# EasyEDA Pro project 密码存储器.eprj, schematic Schematic2
Board Name: Board2; Create Date: 2025-01-25; Page Name: P1; Project Name: 密码存储器; Schematic Name: Schematic2; Update Date: 2025-01-25; Company: 嘉立创EDA; Page Size: A4; Version: V1.0
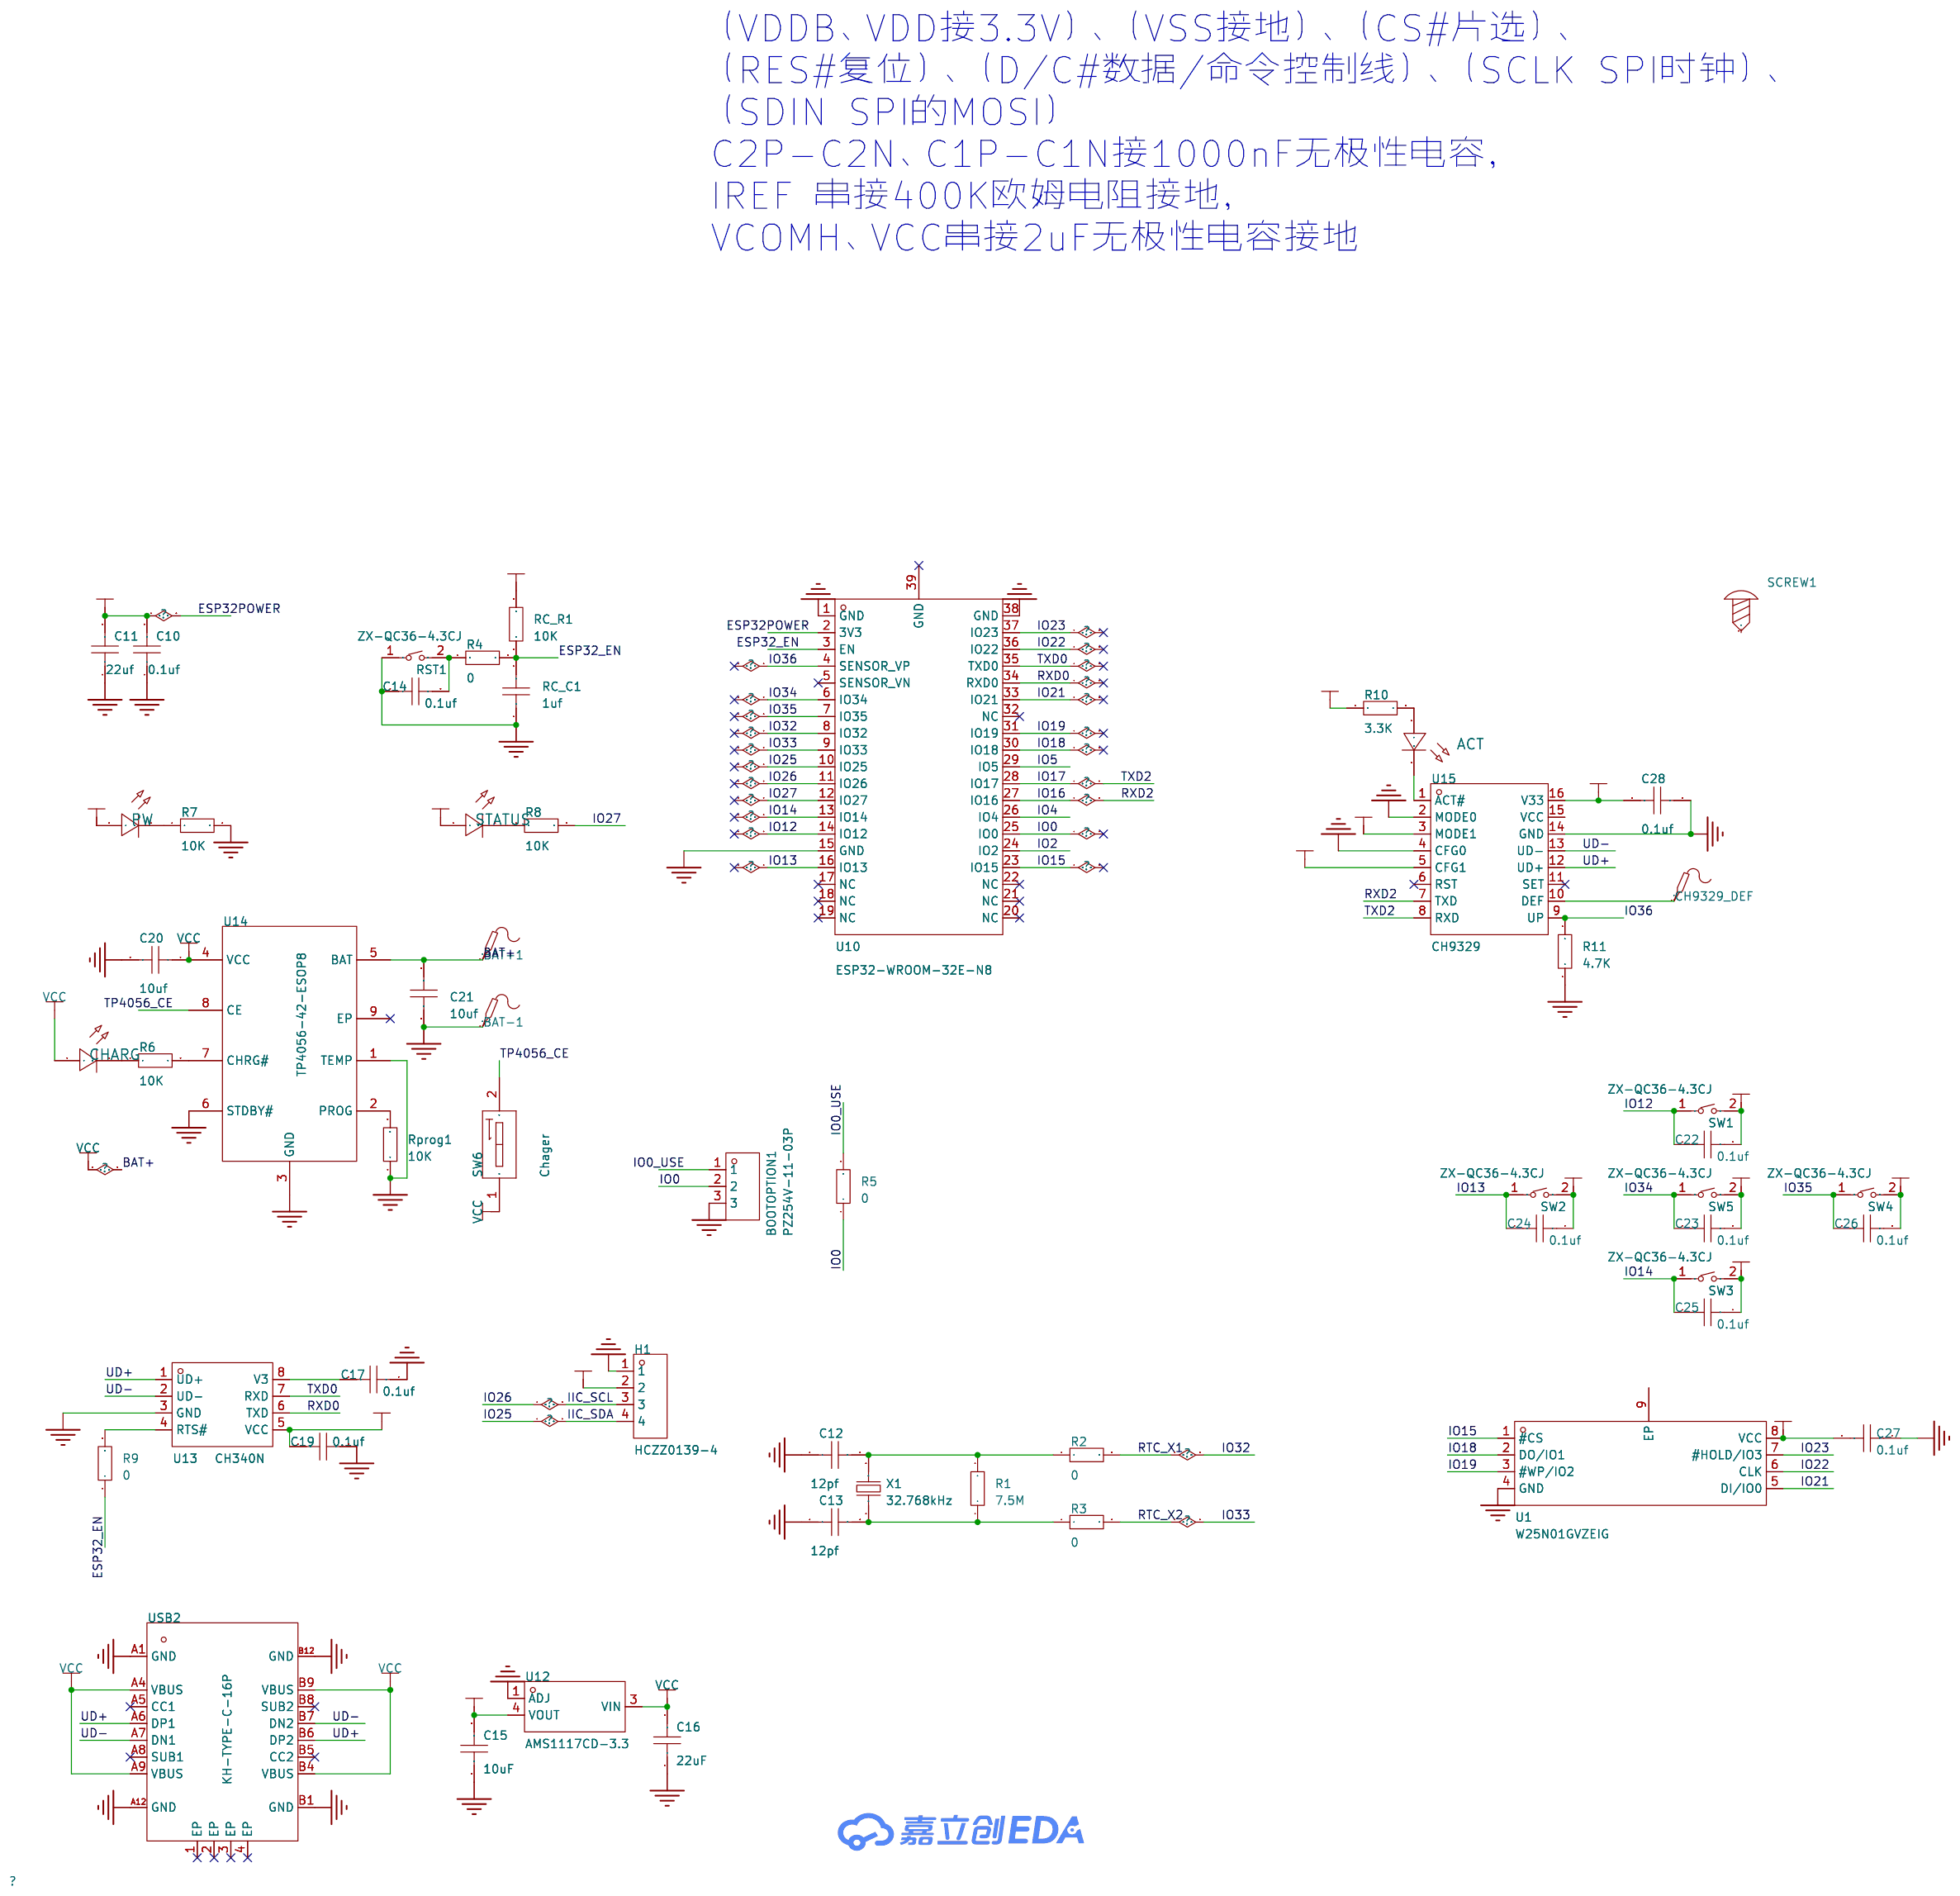
[diagram p1: schematic sheet]

## Parts
ACT  -  [LED_0805]
BAT+1  -  [Test-Point-0.5mm]
BAT-1  -  [Test-Point-0.5mm]
BOOTOPTION1  PZ254V-11-03P  [HDR-TH_3P-P2.54-V-M]
C10  0.1uf  [C0805]
C11  22uf  [C0805]
C12  12pf  [C0805]
C13  12pf  [C0805]
C14  0.1uf  [C0805]
C15  10uF  [CAP-SMD_L2.1-W1.4-FD]
C16  22uF  [CAP-SMD_L2.1-W1.4-FD]
C17  0.1uf  [C0805]
C19  0.1uf  [C0805]
C20  10uf  [C0805]
C21  10uf  [C0805]
C22  0.1uf  [C0805]
C23  0.1uf  [C0805]
C24  0.1uf  [C0805]
C25  0.1uf  [C0805]
C26  0.1uf  [C0805]
C27  0.1uf  [C0805]
C28  0.1uf  [C0805]
CH9329_DEF  -  [Test-Point-0.5mm]
CHARG  -  [LED_0805]
H1  HCZZ0139-4  [CONN-TH_4P-P2.50_HCZZ0139-4]
PW  -  [LED_0805]
R1  7.5M  [R0805]
R2  0  [R0805]
R3  0  [R0805]
R4  0  [R0805]
R5  0  [R0805]
R6  10K  [R0805]
R7  10K  [R0805]
R8  10K  [R0805]
R9  0  [R0805]
R10  3.3K  [R0805]
R11  4.7K  [R0805]
RC_C1  1uf  [C0805]
RC_R1  10K  [R0805]
Rprog1  10K  [R0805]
RST1  ZX-QC36-4.3CJ  [KEY-TH_L6.0-W3.5-P6.50]
SCREW1  -  [M3螺丝]
STATUS  -  [LED_0805]
SW1  ZX-QC36-4.3CJ  [KEY-TH_L6.0-W3.5-P6.50]
SW2  ZX-QC36-4.3CJ  [KEY-TH_L6.0-W3.5-P6.50]
SW3  ZX-QC36-4.3CJ  [KEY-TH_L6.0-W3.5-P6.50]
SW4  ZX-QC36-4.3CJ  [KEY-TH_L6.0-W3.5-P6.50]
SW5  ZX-QC36-4.3CJ  [KEY-TH_L6.0-W3.5-P6.50]
SW6  Chager  [SW-TH_DSWB01LHGET]
U1  W25N01GVZEIG  [WSON-8_L8.0-W6.10-P1.27-TL-EP]
U10  ESP32-WROOM-32E-N8  [WIFI-SMD_ESP32-WROOM-32E]
U12  AMS1117CD-3.3  [TO-252-2_L6.5-W6.1-P4.58-LS10.0-BR]
U13  CH340N  [SOP-8_L4.9-W3.9-P1.27-LS6.0-BL]
U14  TP4056-42-ESOP8  [ESOP-8_L4.9-W3.9-P1.27-LS6.0-BL-EP]
U15  CH9329  [SOP-16_L9.9-W3.9-P1.27-LS6.0-BL]
USB2  KH-TYPE-C-16P  [USB-C-SMD_KH-TYPE-C-16P]
X1  32.768kHz  [FC-135R_L3.2-W1.5]

## Library data of the parts
ACT = LED_0805-R: Supplier Footprint: 0805
BAT+1 BAT-1 = Test-Point: Test Point 测试点; Check: true
BOOTOPTION1 = PZ254V-11-03P: 插针结构:1x3P;间距:2.54mm;行距:-;圆针/方针:方针;安装类型:直插;排数:单排;总PIN位数:3P;额定电流:3A;额定电压:250V;配合针长度:6mm;塑高:2.5mm;端接针长度:3mm;工作温度范围:-40℃~+105℃;颜色:黑色;; LCSC Part Name: 间距:2.54mm 1x3P 直插 方针; Supplier Part: C2937625; Manufacturer: XFCN(兴飞); Supplier Footprint: 插件,P=2.54mm; JLCPCB Part Class: 扩展库; Datasheet: https://atta.szlcsc.com/upload/public/pdf/source/20200309/C492402_8335C3D49C4E4C618838D59BB1D024C1.pdf; Supplier: LCSC; Pin Structure: 1x3P; Pitch: 2.54mm; Circluar Pins/Square Pins: 方针; Mounting Type: 直插; Number of Rows: 单排; Number of Pins: 3P; Current Rating (Max): 3A; Voltage Rating (Max): 250V; Length of Mating Pin: 6mm; Insulation Height: 2.5mm; Length of End Connection Pin: 3mm; Operating Temperature Range: -40℃~+105℃; Color: 黑色; Check: true
C10-C14 C17 C19-C27 RC_C1 = CAP_0805: Supplier Footprint: 0805; Check: true
C15 C16 = TAJP106M010RNJ: LCSC Part Name: 10uF ±20% 10V; Supplier Part: C1952866; Manufacturer: Kyocera AVX; Supplier Footprint: 0805; JLCPCB Part Class: Extended Part; Datasheet: https://atta.szlcsc.com/upload/public/pdf/source/20200508/C528414_E7647BF5233468AE8B10D12AED045AE0.pdf; Supplier: LCSC; Tolerance: ±20%; Voltage Rated: 10V; Equivalent Series Resistance(ESR): 6Ω; Operating Temperature: -55℃~+125℃
C28 = CAP_0805: Supplier Footprint: 0805
CH9329_DEF = Test-Point: Test Point 测试点
CHARG = LED_0805-R: 充电指示; Supplier Footprint: 0805; Check: true
H1 = HCZZ0139-4: LCSC Part Name: 米色 1x4P 间距:2.5mm 弯插 系列:XH; Supplier Part: C7433739; Manufacturer: HC(虹成电子); Supplier Footprint: 弯插,p=2.54mm; JLCPCB Part Class: Extended Part; Datasheet: https://atta.szlcsc.com/upload/public/pdf/source/20250106/5080EEC5004CD340B84A691F8C6625BC.pdf; Supplier: LCSC; Pins Structure: 1x4P; Pitch: 2.5mm; Mounting Type: 弯插; Reference Series: XH; Number of Pins: 4P; Number of Rows: 1; Number of PINs Per Row: 4; Current Rating: 3A; Contact Material: 铜; Contact Plating: 锡; Operating Temperature: -25℃~+85℃; Voltage Rating: 250V; Plastic Material: PA66; Color: 米色; Z-Height of the Board: 5.8mm; X-Length of Bottom Edge on Board (Spacing Line): 12.5mm; Y-Width of Bottom Edge on Board: 7mm
PW = LED_0805-R: 电源指示; Supplier Footprint: 0805
R1-R8 RC_R1 Rprog1 = Res_0805: Supplier Footprint: 0805; Check: true
R9-R11 = Res_0805: Supplier Footprint: 0805
RST1 SW1-SW5 = ZX-QC36-4.3CJ: 电路结构:单刀单掷;按钮形状:矩形按钮;作用力:2.6N;安装方式:直插;开关长度:3mm;开关宽度:6mm;开关高度:4.3mm;带支架:不带支架;触点电流:50mA;额定电压:12V;机械寿命:10万次;; LCSC Part Name: 3*6*4.3插件开关; Supplier Part: C7470223; Manufacturer: Megastar(兆星); Supplier Footprint: DIP; JLCPCB Part Class: 扩展库; Datasheet: https://atta.szlcsc.com/upload/public/pdf/source/20230724/E786959C53B2405F67FB2C8E5CC6989E.pdf; Supplier: LCSC; Circuit: 单刀单掷; Actuator Style: 矩形按钮; Operating Force: 2.6N; Mounting Style: 直插; Switch Length: 3mm; Switch Width: 6mm; Switch Height: 4.3mm; Strike Gundam: 不带支架; Contact Current: 50mA; Voltage Rating: 12V; Actuator/Cap Color: 白色; Pin Style: PC引脚; Mechanical Life: 10万次; Operating Temperature: -30℃~+80℃; Check: true
SCREW1 = M3螺丝: Supplier Footprint: 插件
STATUS = LED_0805-R: 状态指示灯; Supplier Footprint: 0805
SW6 = DSWB01LHGET: 类型:平拨,凸起式;电路结构:单刀单掷;开关位数:1位;使用寿命:-;颜色:红色;; LCSC Part Name: 红色宽体1位顶拨插件; Supplier Part: C126888; Manufacturer: YE; Supplier Footprint: 插件,9.9x4mm; JLCPCB Part Class: 扩展库; Datasheet: https://atta.szlcsc.com/upload/public/pdf/source/20240423/2AB41BE17D24959C6789B2A71E54D492.pdf; Supplier: LCSC; Type: 平拨,凸起式; Circuit: 单刀单掷; Number of Positions: 1位; Color: 红色; Check: true
U1 = W25N01GVZEIG_C88868: Supplier Part: C88868; Manufacturer: WINBOND(华邦); Supplier Footprint: WSON-8-EP(6.1x8); JLCPCB Part Class: 扩展库; Datasheet: https://atta.szlcsc.com/upload/public/pdf/source/20180428/C88868_D3C946FD371B1278FED16ED9DB2A4B79.pdf; Supplier: LCSC; Memory Size: 1Gbit; Clock Frequency (fc): 104MHz; Supply Voltage: 2.7V~3.6V; Page Program time (TPP): 250us; Block Erase Time (tBE): 2ms; Data Retention - TDR (Year): 10年; Operating Temperature: -40℃~+85℃; Interface Type: SPI
U10 = ESP32-WROOM-32E-N8: LCSC Part Name: 通用型Wi-Fi+BT+BLE MCU模组; Supplier Part: C701342; Manufacturer: ESPRESSIF(乐鑫); Supplier Footprint: SMD,18x25.5mm; JLCPCB Part Class: 扩展库; Datasheet: https://atta.szlcsc.com/upload/public/pdf/source/20240307/DEBA00FAE5BA634F0D73085E4F214E93.pdf; Supplier: LCSC; Check: true
U12 = AMS1117CD-3.3: LCSC Part Name: 输出:3.3V 电流:1A 耐压:12V; Supplier Part: C347249; Manufacturer: UMW(友台半导体); Supplier Footprint: TO-252-2; JLCPCB Part Class: 扩展库; Datasheet: https://atta.szlcsc.com/upload/public/pdf/source/20241218/BAF0263FA2E44BCD8AF41AA4FA04EFAA.pdf; Supplier: LCSC; Output Type: 固定; Maximum Input Voltage: 18V; Output Voltage: 3.3V; Output Current: 1A; Power Supply Rejection Ratio (PSRR): 75dB@(120Hz); Dropout Voltage: 1.3V@(1A); standby current: 10mA; Feature: 过流保护(OCP); Operating Temperature: -40℃~+125℃@(Tj); Output Polarity: 正极; Number of Outputs: 1; Check: true
U13 = CH340N: LCSC Part Name: USB转串口芯片CH340; Supplier Part: C2977777; Manufacturer: WCH(南京沁恒); Supplier Footprint: SOP-8; JLCPCB Part Class: 扩展库; Datasheet: https://atta.szlcsc.com/upload/public/pdf/source/20240313/115CDE92081B1D6CB446704AD5D0F5F2.pdf; Supplier: LCSC; Applications Function: USB转串口; Protocol: USB 2.0; Number of Channels: 1; Supply Voltage: 3.3V；5V; Data Rate: 2Mbps; Operating Temperature: -20℃~+70℃; Check: true
U14 = TP4056-42-ESOP8: Supplier Part: C16581; Manufacturer: TOPPOWER(南京拓微); Supplier Footprint: ESOP-8; JLCPCB Part Class: 扩展库; Datasheet: https://atta.szlcsc.com/upload/public/pdf/source/20190626/C16581_611BCF5D7CF554EAE465137A8F68DB3E.pdf; Supplier: LCSC; Check: true
U15 = CH9329_C2838834: Supplier Part: C2838834; Manufacturer: WCH(南京沁恒); Supplier Footprint: SOP-16; JLCPCB Part Class: 扩展库; Datasheet: https://atta.szlcsc.com/upload/public/pdf/source/20210707/C2838834_51EE7D8ADE40BFE4760F92CB8535ADA1.pdf; Supplier: LCSC
USB2 = KH-TYPE-C-16P: 连接器类型:Type-C;标准:-;公母:母;端口数量:1;触点数量:16P;安装方式:卧贴;额定电流 - 电源:3A;工作温度范围:-40℃~+85℃;; LCSC Part Name: Type-C 母 卧贴; Supplier Part: C709357; Manufacturer: kinghelm(金航标); Supplier Footprint: SMD; JLCPCB Part Class: 扩展库; Datasheet: https://atta.szlcsc.com/upload/public/pdf/source/20200911/C709357_AA8DCEB38BB20E3035A7ED7AE7667837.pdf; Supplier: LCSC; Connector Type: Type-C; Gender: 母; Number of Ports: 1; Number of Contacts: 16P; Mounting Style: 卧贴; Current Rating - Power (Max): 3A; Operating Temperature Range: -40℃~+85℃; Check: true
X1 = Q13FC13500004_C32346: 晶振类型:贴片晶振;频率:32.768kHz;常温频差:±20ppm;负载电容:12.5pF;; LCSC Part Name: 32.768kHz ±20ppm 12.5pF; Supplier Part: C32346; Manufacturer: EPSON(爱普生); Manufacturer Part: Q13FC13500004; Supplier Footprint: SMD3215-2P; JLCPCB Part Class: 基础库; Datasheet: https://atta.szlcsc.com/upload/public/pdf/source/20240418/0E0FF5F0356BA3753F616001439D1416.pdf; Supplier: LCSC; Crystal Type: 贴片晶振; Normal temperature Frequency Tolerance: ±20ppm; Load Capacitor: 12.5pF; Equivalent Series Resistance (ESR): 70kΩ; Operating Temperature: -40℃~+85℃; Check: true

## Nets
GND: BAT-1.1 BOOTOPTION1.3 C10.1 C11.1 C12.1 C13.1 C14.1 C15.1 C16.1 C17.2 C19.2 C20.2 C21.1 C27.1 C28.1 H1.1 R7.2 R11.1 RC_C1.1 Rprog1.1 RST1.1 U1.4(GND) U10.1(GND) U10.15(GND) U10.38(GND) U12.1(ADJ) U13.3(GND) U14.1(TEMP) U14.3(GND) U14.6(STDBY#) U15.2(MODE0) U15.4(CFG0) U15.14(GND) USB2.A1(GND) USB2.A12(GND) USB2.B1(GND) USB2.B12(GND)
VCC: BAT+1.1 C16.2 C20.1 C21.2 CHARG.2(A) SW6.1(A1) U12.3(VIN) U14.4(VCC) U14.5(BAT) USB2.A4(VBUS) USB2.A9(VBUS) USB2.B4(VBUS) USB2.B9(VBUS)
VDD33: C10.2 C11.2 C15.2 C19.1 C22.2 C23.2 C24.2 C25.2 C26.2 C27.2 C28.2 H1.2 PW.2(A) R10.1 RC_R1.2 STATUS.2(A) SW1.2 SW2.2 SW3.2 SW4.2 SW5.2 U1.8(VCC) U10.2(3V3) U12.4(VOUT) U13.5(VCC) U15.3(MODE1) U15.5(CFG1) U15.16(V33)
ESP32_EN: R4.2 R9.1 RC_C1.2 RC_R1.1 U10.3(EN)
IIC_SCL: H1.3 U10.11(IO26)
IIC_SDA: H1.4 U10.10(IO25)
IO0: BOOTOPTION1.2 R5.1 U10.25(IO0)
IO0_USE: BOOTOPTION1.1 R5.2
IO2: U10.24(IO2)
IO4: U10.26(IO4)
IO5: U10.29(IO5)
IO12: C22.1 SW1.1 U10.14(IO12)
IO13: C24.1 SW2.1 U10.16(IO13)
IO14: C25.1 SW3.1 U10.13(IO14)
IO15: U1.1(#CS) U10.23(IO15)
IO16: U10.27(IO16) U15.7(TXD)
IO17: U10.28(IO17) U15.8(RXD)
IO18: U1.2(DO/IO1) U10.30(IO18)
IO19: U1.3(#WP/IO2) U10.31(IO19)
IO21: U1.5(DI/IO0) U10.33(IO21)
IO22: U1.6(CLK) U10.36(IO22)
IO23: U1.7(#HOLD/IO3) U10.37(IO23)
IO27: R8.2 U10.12(IO27)
IO32: R2.2 U10.8(IO32)
IO33: R3.2 U10.9(IO33)
IO34: C23.1 SW5.1 U10.6(IO34)
IO35: C26.1 SW4.1 U10.7(IO35)
IO36: R11.2 U10.4(SENSOR_VP) U15.9(UP)
RXD0: U10.34(RXD0) U13.6(TXD)
TP4056_CE: SW6.2 U14.8(CE)
TXD0: U10.35(TXD0) U13.7(RXD)
UD+: U13.1(UD+) U15.12(UD+) USB2.A6(DP1) USB2.B6(DP2)
UD-: U13.2(UD-) U15.13(UD-) USB2.A7(DN1) USB2.B7(DN2)
$1N2842: C14.2 R4.1 RST1.2
$1N2858: R6.2 U14.7(CHRG#)
$1N2859: CHARG.1(C) R6.1
$1N2862: Rprog1.2 U14.2(PROG)
$1N2886: R9.2 U13.4(RTS#)
$1N2889: C17.1 U13.8(V3)
$1N2903: C12.2 R1.2 R2.1 X1.2
$1N2904: C13.2 R1.1 R3.1 X1.1
$1N2982: PW.1(C) R7.1
$1N2983: R8.1 STATUS.1(C)
$1N3524: ACT.1(C) U15.1(ACT#)
$1N3550: ACT.2(A) R10.2
$1N3609: CH9329_DEF.1 U15.10(DEF)

Not connected (* = marked no-connect by the designer): SCREW1 1; U1 9(EP); U10 5(SENSOR_VN)* 17(NC)* 18(NC)* 19(NC)* 20(NC)* 21(NC)* 22(NC)* 32(NC)* 39(GND)*; U14 9(EP)*; U15 6(RST)* 11(SET)* 15(VCC); USB2 1(EP)* 2(EP)* 3(EP)* 4(EP)* A5(CC1)* A8(SUB1)* B5(CC2)* B8(SUB2)*

## Notes on the sheet
- （VDDB、VDD接3.3V）、（VSS接地）、（CS#片选）、
  （RES#复位）、（D/C#数据/命令控制线）、（SCLK SPI时钟）、
  （SDIN SPI的MOSI）
  C2P-C2N、C1P-C1N接1000nF无极性电容，
  IREF 串接400K欧姆电阻接地，
  VCOMH、VCC串接2uF无极性电容接地
